# EAGLE design ESP8266-PIR (EAGLE 7.6.0)
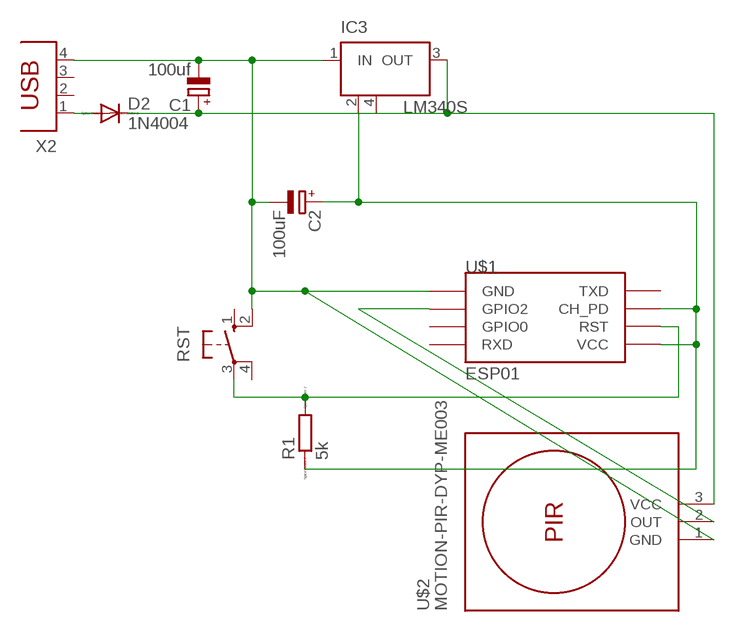
[diagram p0: schematic, sheet 1]

## Parts
C1  100uf  CPOL-EUE2.5-5  [E2,5-5]
C2  100uF  CPOL-EUE2.5-5  [E2,5-5]
D2  1N4004  [DO41-10]
IC3  LM340S  [SOT223]
R1  5k  R0204/7  [0204/7]
RST  10-XX  [B3F-10XX]
U$1  ESP01  [ESP01]
U$2  MOTION-PIR-DYP-ME003  [MOTION-PIR-DYP-ME003]
X2  PN61729  [PN61729]

## Nets
3V3: C2.+ IC3.2(GND) R1.1 U$1.CH_PD U$1.VCC
5V: C1.+ D2.A D2.C IC3.3(OUT) U$2.3(VCC) X2.1
GND: C1.- C2.- IC3.1(IN) RST.2(S1) U$1.GND U$2.1(GND) X2.4
GPIO2: U$1.GPIO2 U$2.2(OUT)
N$4: R1.2 RST.3(P) U$1.RST
Unconnected: RST.1(S) RST.4(P1) U$1.GPIO0 U$1.RX(RXD) U$1.TX(TXD) X2.2 X2.3

## Power pins joined to a net without a drawn wire
GND: IC3.4(GND)

## Library data of the parts
C1 C2 = rcl:CPOL-EU: POLARIZED CAPACITOR, European symbol
D2 = diode:1N4004: DIODE general purpose rectifier, 1 A
IC3 = linear:LM340S: 3-Terminal Positive Regulators Source: http://cache.national.com/ds/LM/LM340.pdf
R1 = eagle-ltspice:R: RESISTOR, European symbol; SPICEMODEL: NONE; SPICEPREFIX: R
RST = switch-omron:10-XX: OMRON SWITCH; MPN: B3F-1000; OC_FARNELL: 176432; OC_NEWARK: 36M3542
U$1 = esp8266modules:ESP01: ESP8266 Wifi module 01
U$2 = diy-modules:MOTION-PIR-DYP-ME003: PIR Motion Sensor Module DYP-ME003 based on BISS0001 pyroelectic detector
X2 = con-berg:PN61729: BERG USB connector; OC_FARNELL: unknown; OC_NEWARK: unknown

## Board
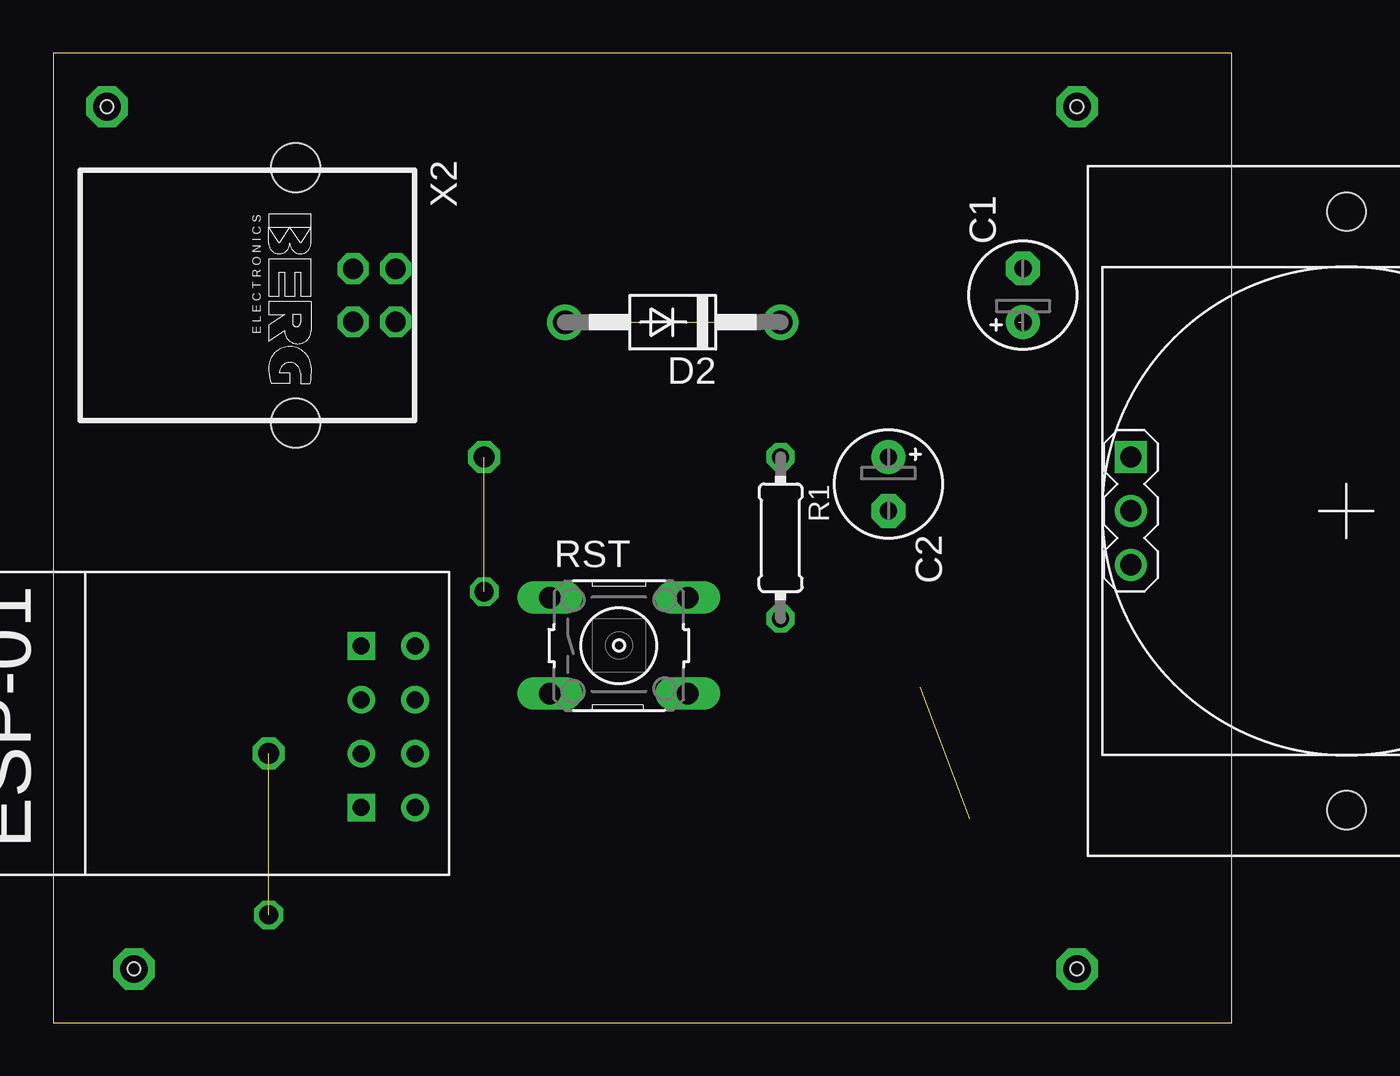
[diagram p1: board, top side]
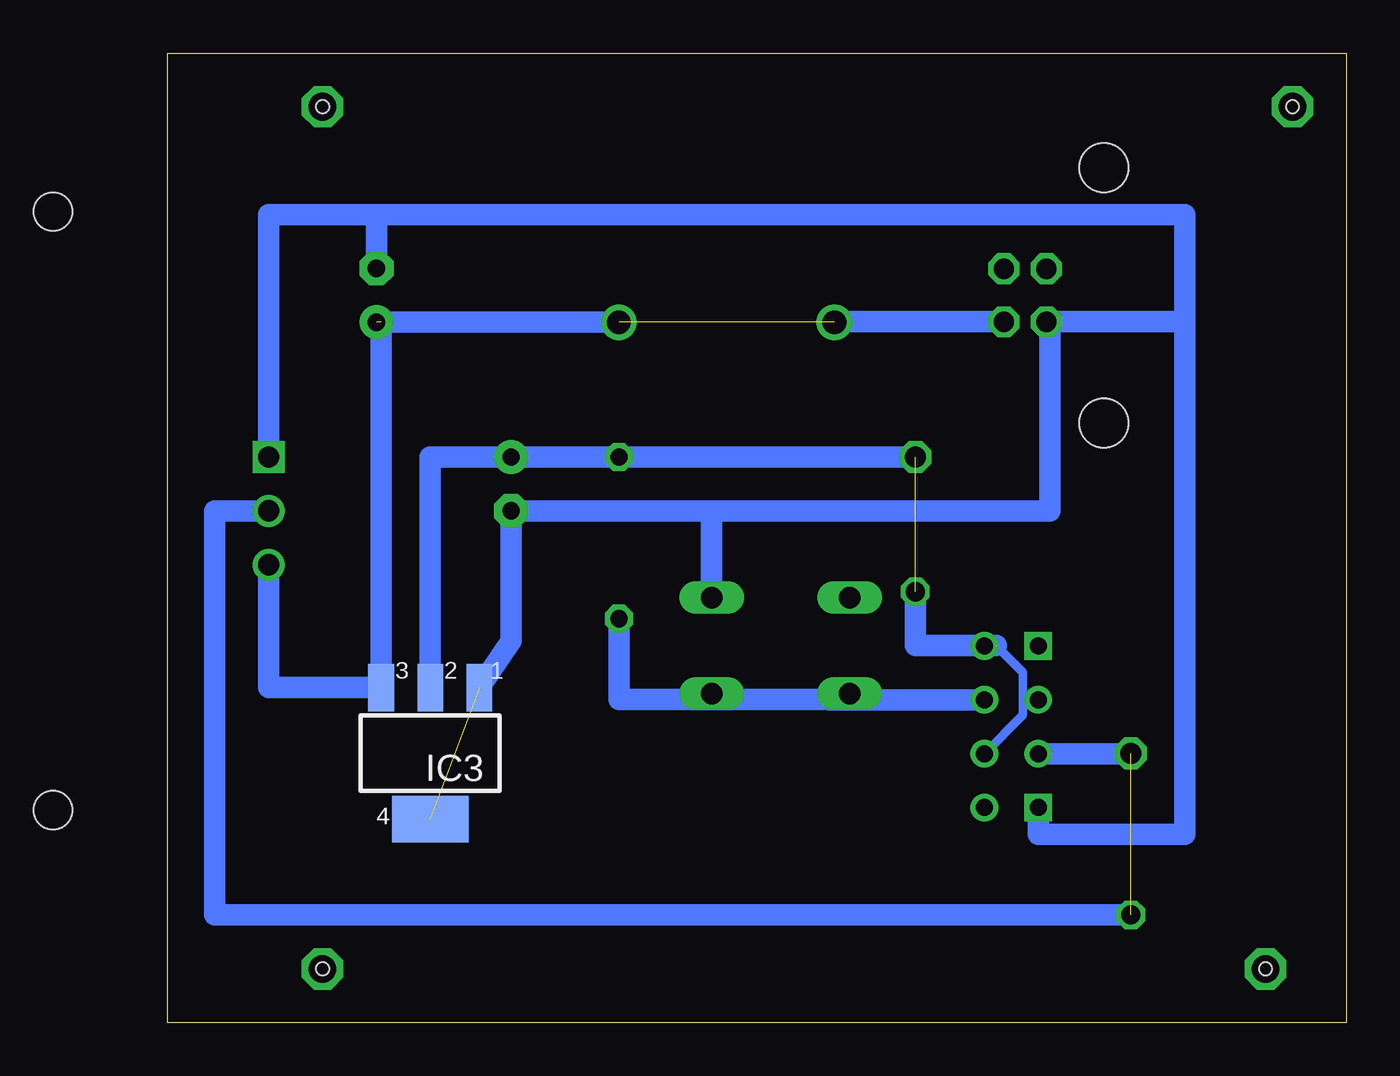
[diagram p2: board, bottom side, seen from below]

Size 55.55 x 45.71 mm. Coordinates in mm from the lower left corner, seen from the top.
Outline: 0,0 55.55,0 55.55,45.71 0,45.71 0,0
Copper layers (1*16): Top 0.035mm / dielectric 1.5mm / Bottom 0.035mm
Design rules "default": minimum track width 10mil, minimum drill 24mil, track to track 8mil, track to pad 8mil, pad to pad 8mil, via to via 8mil, smd to smd 8mil, copper to edge 40mil, drill to drill 8mil, minimum pad ring 10mil, minimum via ring 8mil, stop-mask expansion 4mil, vias tented up to drill 0mil, thermal gap 10mil
Holes 0.6 mm at 3.81,2.54 48.26,2.54 2.54,43.18 48.26,43.18

### Footprints (pad centres in the part's own frame; a part is rotated, then mirrored left to right if it is on the bottom)
E2,5-5 = drill 0.813 pad 1.6: + -1.27,0 | drill 0.813 pad 1.6 octagon: - 1.27,0
DO41-10 = drill 1.118: A 5.08,0; C -5.08,0
SOT223 = smd 1.219 x 2.235: 1 -2.311,-3.099; 2 0,-3.099; 3 2.311,-3.099 | smd 3.6 x 2.2: 4 0,3.099
0204/7 = drill 0.813 octagon: 1 -3.81,0; 2 3.81,0
B3F-10XX = drill 1.016 long: 1 -3.251,2.261; 2 3.251,2.261; 3 -3.251,-2.261; 4 3.251,-2.261
ESP01 = drill 0.8: CH_PD -1.285,-8.178; GPIO0 1.255,-5.638; GPIO2 -1.285,-5.638; RST 1.255,-8.178; TX -3.825,-8.178; VCC 3.795,-8.178 | drill 0.8 square: GND -3.825,-5.638; RX 3.795,-5.638
MOTION-PIR-DYP-ME003 = drill 1 square: 1 -2.54,-10.16 | drill 1: 2 0,-10.16; 3 2.54,-10.16 | hole 1.8: -14.1,0; 14.1,0
PN61729 = drill 0.95 octagon: 1 1.25,4.71; 2 -1.25,4.71; 3 -1.25,2.71; 4 1.25,2.71 | hole 2.3: -6.02,0; 6.02,0

### Placement (x,y rotation side)
C1  45.72,34.29 90 top
C2  39.37,25.4 270 top
D2  29.21,33.02 180 top
IC3  43.18,12.7 180 bottom
R1  34.29,22.86 270 top
RST  26.67,17.78 0 top
U$1  8.89,13.97 90 top
U$2  60.96,24.13 270 top
X2  11.43,34.29 270 top

### Tracks (layer width: path | path; a pad name or v marks a point on that pad's centre or on a via)
3V3  (via drill 0.9)  (2 unrouted)
  Bottom 0.406: U$1.VCC 16.5,17.77 15.24,16.51 15.24,14.51 U$1.CH_PD
  Bottom 1.016: 16.51,17.78 20.32,17.78 v20.32,20.32 | IC3.2 43.18,26.67 C2.+ R1.1 20.32,26.67
5V  (2 unrouted)
  Bottom 1.016: X2.1 24.13,33.04 D2.A | D2.C 45.49,33.02 IC3.3 50.8,15.8 U$2.3
GND  (1 unrouted)
  Bottom 1.016: 7.62,33.04 X2.4 13.97,33.04 13.97,24.13 29.92,24.13 | 7.62,33.04 7.62,8.88 14.53,8.88 U$1.GND | 29.92,24.13 RST.2 | 45.72,38.1 7.62,38.1 7.62,33.04 | 29.92,24.13 C2.- 39.37,18.01 IC3.1 | C1.- 45.72,38.1 | U$2.1 50.8,38.1 45.72,38.1
GPIO2  (1 unrouted)
  Bottom 0.406: 10.18,12.69 10.16,12.7
  Bottom 1.016: U$1.GPIO2 10.18,12.69 | U$2.2 53.34,24.13 53.34,5.08 10.16,5.08
N$1  (via drill 0.9)
  other vias: 10.16,5.08
N$2  (via drill 1)
  other vias: 20.32,26.67
N$3  (via drill 1)
  other vias: 10.16,12.7
N$4
  Bottom 1.016: U$1.RST 24.39,15.23 RST.3 24.69,15.24 34.29,15.24 R1.2
N$5  (via drill 1.3)
  other vias: 48.26,2.54
N$6  (via drill 1.3)
  other vias: 3.81,2.54
N$7  (via drill 1.3)
  other vias: 48.26,43.18
N$8  (via drill 1.3)
  other vias: 2.54,43.18